# EAGLE design Grillo_v_0_1 (EAGLE 9.5.1)
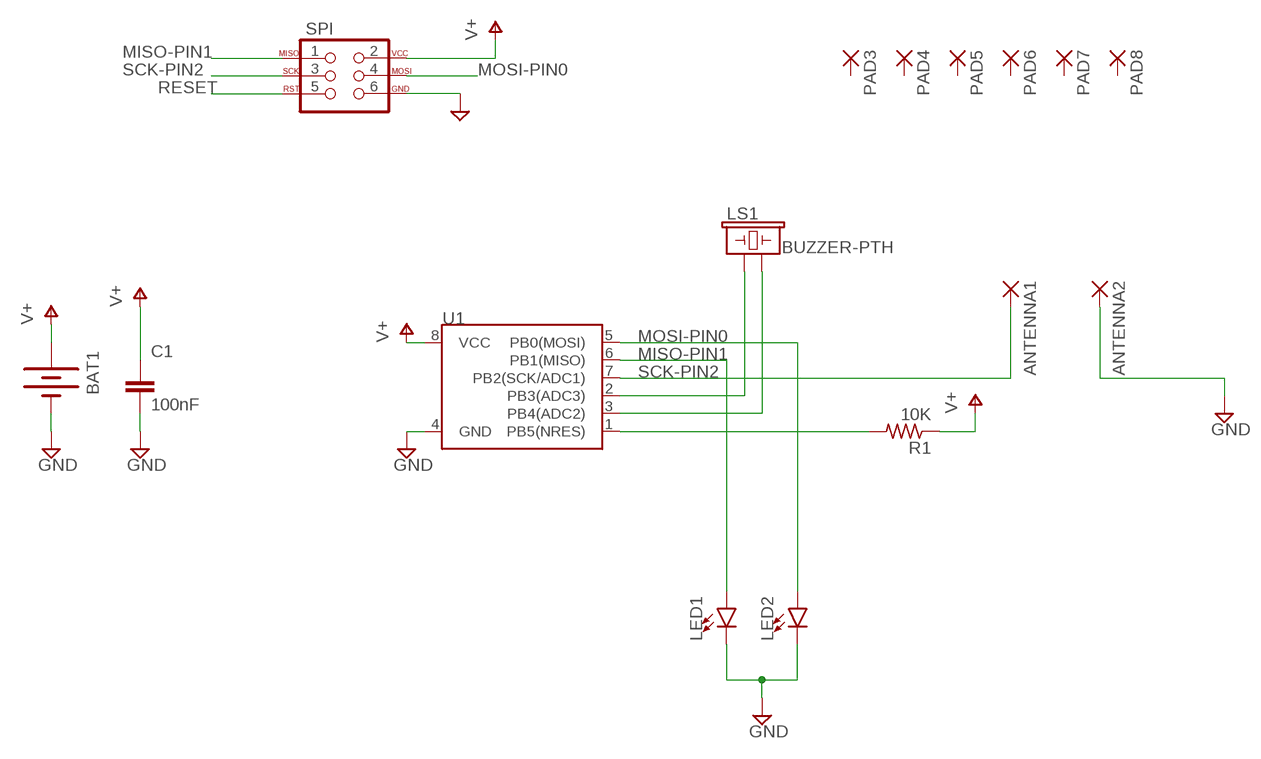
[diagram p0: schematic, sheet 1]

## Parts
ANTENNA1  1,6/0,9  [1,6/0,9]
ANTENNA2  1,6/0,9  [1,6/0,9]
BAT1  BATTERY20PTH  [BATTCOM_20MM_PTH]
C1  100nF  C-EU050-024X044  [C050-024X044]
LED1  LED3MM  [LED_3MM]
LED2  LED3MM  [LED_3MM]
LS1  BUZZER-PTH  [BUZZER-12MM]
PAD3  1,6/0,9  [1,6/0,9]
PAD4  1,6/0,9  [1,6/0,9]
PAD5  1,6/0,9  [1,6/0,9]
PAD6  1,6/0,9  [1,6/0,9]
PAD7  1,6/0,9  [1,6/0,9]
PAD8  1,6/0,9  [1,6/0,9]
R1  10K  R-US_0204/7  [0204/7]
SPI  AVR_SPI_PROG_3X2PTH  [2X3]
U1  ATTINY45TINY85-20-DIP  [DIP08]

## Nets
GND: ANTENNA2.1(P) BAT1.2(-) C1.2 LED1.K(C) LED2.K(C) SPI.6 U1.4(GND)
MISO-PIN1: LED1.A SPI.1 U1.6(PB1(MISO))
MOSI-PIN0: LED2.A SPI.4 U1.5(PB0(MOSI))
N$3: LS1.+ U1.2(PB3(ADC3))
N$4: LS1.- U1.3(PB4(ADC2))
RESET: R1.2 SPI.5 U1.1(PB5(NRES))
SCK-PIN2: ANTENNA1.1(P) SPI.3 U1.7(PB2(SCK/ADC1))
V+: BAT1.1(+) C1.1 R1.1 SPI.2 U1.8(VCC)
Unconnected: PAD3.1(P) PAD4.1(P) PAD5.1(P) PAD6.1(P) PAD7.1(P) PAD8.1(P)

## Library data of the parts
ANTENNA1 ANTENNA2 PAD3-PAD8 = wirepad:1,6/0,9: THROUGH-HOLE PAD
BAT1 = SparkFun-Electromechanical:BATTERY: Battery Holders Various common sizes : AA, AAA, 20mm coin cell and 12mm coin cell. 20MM_4LEGS, BATT-10373
C1 = rcl:C-EU: CAPACITOR, European symbol
LED1 LED2 = SparkFun-LED:LED: LED (Generic) Standard schematic elements and footprints for 5mm, 3mm, 1206, and 0603 sized LEDs. Generic LEDs with no color specified.; PROD_ID: DIO-08794
LS1 = SparkFun-Electromechanical:BUZZER: Buzzer Small round buzzers that operate around the audible 2kHz range. You can use these as speakers to create simple music or user interfaces. Variant Overview: PTH - Mini Speaker - PC Mount 12mm 2.048kHz <https://www.sparkfun.com/products/7950> PTH_KIT - Mini Speaker - PC Mount 12mm 2.048kHz <https://www.sparkfun.com/products/7950> KIT simplifies soldering by adding stop mask to one side of the pads. PTH_NO_SILK - Mini Speaker - PC Mount 12mm 2.048kHz <https://www.sparkfun.com/products/7950> No silkscreen indicator of buzzer outline. PTH_KIT_NO_SILK - Mini Speaker - PC Mount 12mm 2.048kHz <https://www.sparkfun.com/products/7950> KIT package w/o silkscreen SMD - Buzzer Audio Magnetic (CCV-084B16) SMD buzzer used on, e.g. the LilyPad Buzzer <https://www.sparkfun.com/products/8463> and RFID USB Reader <https://www.sparkfun.com/products/9963>. SMD_KIT - Buzzer Audio Magnetic (CCV-084B16) SMD Buzzer with elongated pins to make soldering easier. Used on the SparkFun Simon Says - Surface Mount Soldering Kit <https://www.sparkfun.com/products/10935>.; PROD_ID: COMP-08253; SF_SKU: COM-07950
R1 = adafruit:R-US_: RESISTOR, American symbol
SPI = SparkFun-Connectors:AVR_SPI_PROG_3X2: AVR ISP 6 Pin This is the reduced ISP connector for AVR programming. Common on Arduino. This footprint will take up less PCB space and can be used with a 10-pin to 6-pin adapter such as SKU: BOB-08508 **Special note about "TEST_POINT" package. The stop mask is on the top side, so if you want your programming test points to be on the bottom of your board, make sure to place this package on the bottom side of the board. This also ensure that the orientation to program from the bottom side will be correct. SparkFun Products: SparkFun ISP Pogo Adapter <https://www.sparkfun.com/products/11591> - NS Tiny AVR Programmer <https://www.sparkfun.com/products/11801> -PTH
U1 = SparkFun-DigitalIC:ATTINY45: Atmel 8-pin 2/4/8kB flash uC; PROD_ID: IC-09445; VALUE: TINY85-20-DIP

## Board
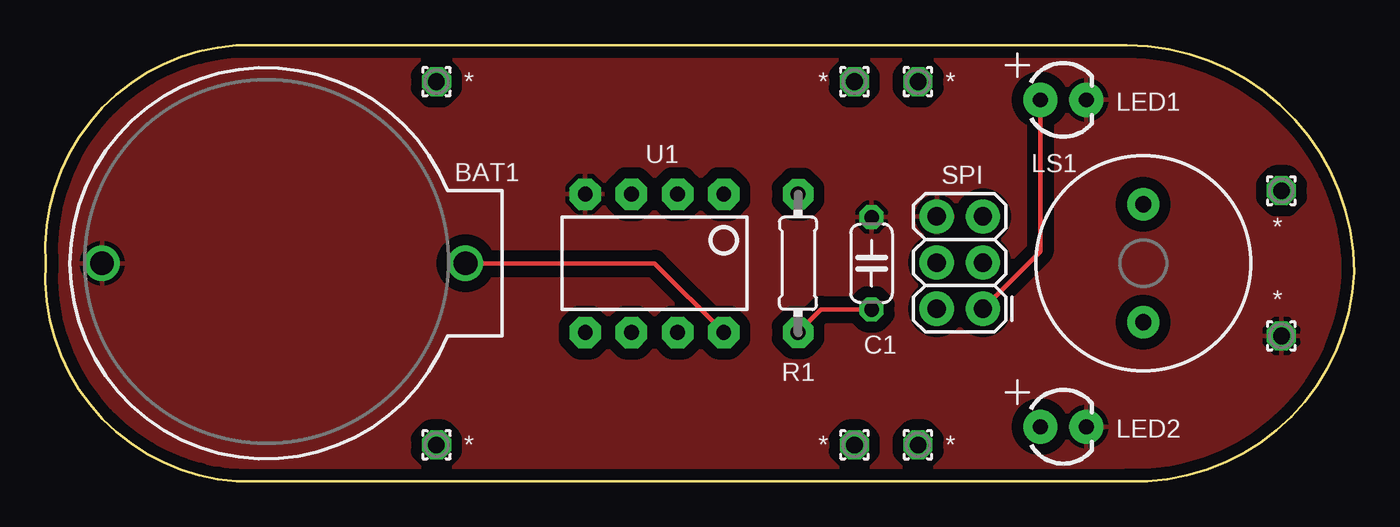
[diagram p1: board, top side]
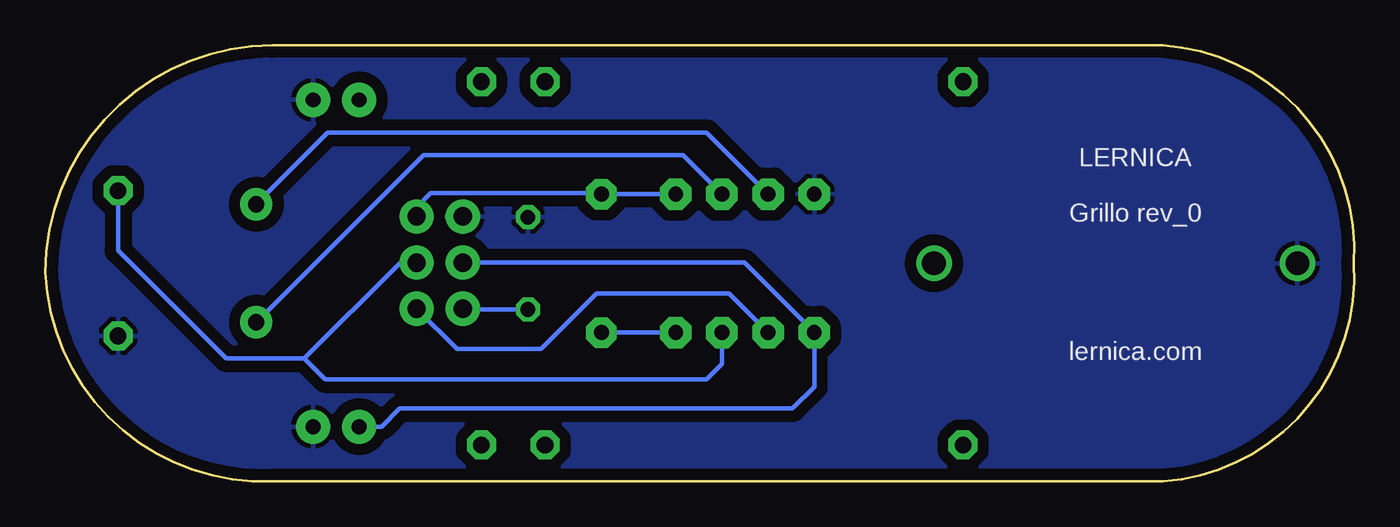
[diagram p2: board, bottom side, seen from below]

Size 72.02 x 24 mm. Coordinates in mm from the lower left corner, seen from the top.
Outline: 59.52,24 arc-90 72.02,11.5 arc-90 59.52,0 10.52,0 arc-90 0.02,12 arc-90 10.52,24 59.52,24
Copper layers (1*16): Top 0.035mm / dielectric 1.5mm / Bottom 0.035mm
Design rules "default": minimum track width 6mil, minimum drill 12mil, track to track 6mil, track to pad 6mil, pad to pad 6mil, via to via 6mil, smd to smd 0mil, copper to edge 10mil, drill to drill 10mil, minimum pad ring 10mil, minimum via ring 6mil, stop-mask expansion 2mil, vias tented up to drill 100mil, thermal gap 10mil

### Footprints (pad centres in the part's own frame; a part is rotated, then mirrored left to right if it is on the bottom)
1,6/0,9 = drill 0.914 pad 1.6 octagon: 1 0,0
BATTCOM_20MM_PTH = drill 1.3: 1 20,0; 2 0,0
C050-024X044 = drill 0.813 octagon: 1 -2.54,0; 2 2.54,0
LED_3MM = drill 0.813 pad 1.88: A -1.27,0; K 1.27,0
BUZZER-12MM = drill 0.9 pad 1.778: + 3.25,0; - -3.25,0
0204/7 = drill 0.813 pad 1.676 octagon: 1 -3.81,0; 2 3.81,0
2X3 = drill 1.016 pad 1.88: 1 0,0; 2 0,2.54; 3 2.54,0; 4 2.54,2.54; 5 5.08,0; 6 5.08,2.54
DIP08 = drill 0.813 pad 1.727 octagon: 1 -3.81,-3.81; 2 -1.27,-3.81; 3 1.27,-3.81; 4 3.81,-3.81; 5 3.81,3.81; 6 1.27,3.81; 7 -1.27,3.81; 8 -3.81,3.81

### Placement (x,y rotation side)
ANTENNA1  68.02,16 0 top
ANTENNA2  68.02,8 0 top
BAT1  3.12,12 0 top
C1  45.47,12 90 top
LED1  56.02,21 0 top
LED2  56.02,3 0 top
LS1  60.42,12 270 top
PAD3  21.52,22 0 top
PAD4  21.52,2 0 top
PAD5  44.52,2 0 top
PAD6  48.02,2 0 top
PAD7  48.02,22 0 top
PAD8  44.52,22 0 top
R1  41.42,12 90 top
SPI  51.59,9.5 90 top
U1  33.52,12 180 top

### Tracks (layer width: path | path; a pad name or v marks a point on that pad's centre or on a via)
GND
  pour Top (isolate 0.61): -7.93,30 -8.43,-5.85 76.92,-5.85 77.42,30
  pour Bottom (isolate 0.61): -5.58,27.7 -5.58,-3.7 74.32,-3.7 74.32,27.7
MISO-PIN1
  Top 0.254: LED1.A 54.75,12.66 SPI.1
  Bottom 0.254: U1.6 34.39,10.33 41.69,10.33 44.74,7.28 49.37,7.28 SPI.1
MOSI-PIN0
  Bottom 0.254: LED2.A 53.52,3 52.52,4 30.9,4 29.71,5.19 U1.5 33.56,12.04 SPI.4
N$3
  Bottom 0.254: U1.2 36.93,17.95 51.22,17.95 LS1.+
N$4
  Bottom 0.254: LS1.- 56.48,19.19 35.63,19.19 U1.3
RESET
  Bottom 0.254: U1.1 R1.2 | SPI.5 51.59,15.08 50.82,15.86 41.42,15.86
  Bottom 0.406: R1.2 41.42,15.86
SCK-PIN2
  Bottom 0.254: SPI.3 52.42,12 arc-45 52.6,11.93 57.77,6.75 | 57.77,6.75 56.7,5.67 arc-45 56.52,5.6 35.65,5.6 34.79,6.46 U1.7 | ANTENNA1.1 68.02,12.7 62.07,6.75 57.77,6.75
V+
  Top 0.254: BAT1.1 33.52,12 U1.8 | R1.1 42.69,9.46 C1.1
  Bottom 0.254: R1.1 U1.8 | C1.1 49.01,9.46 SPI.2

### Text on the board
tPlace: * | * | * | * | * | * | * | *
tNames: U1 | BAT1 | C1 | R1
bNames: LERNICA / / Grillo rev_0 / / / / / lernica.com